# Altium schematic sheet 01_VERSION_HISTORY.SchDoc: =TitleParameter
size A3; Address: Crete IL; Organization: ASISGUARD; Address1: Kemalpasa, Kemalpasa Cd. No:290 D:292H, 35060 Bornova/Izmir/Turkey
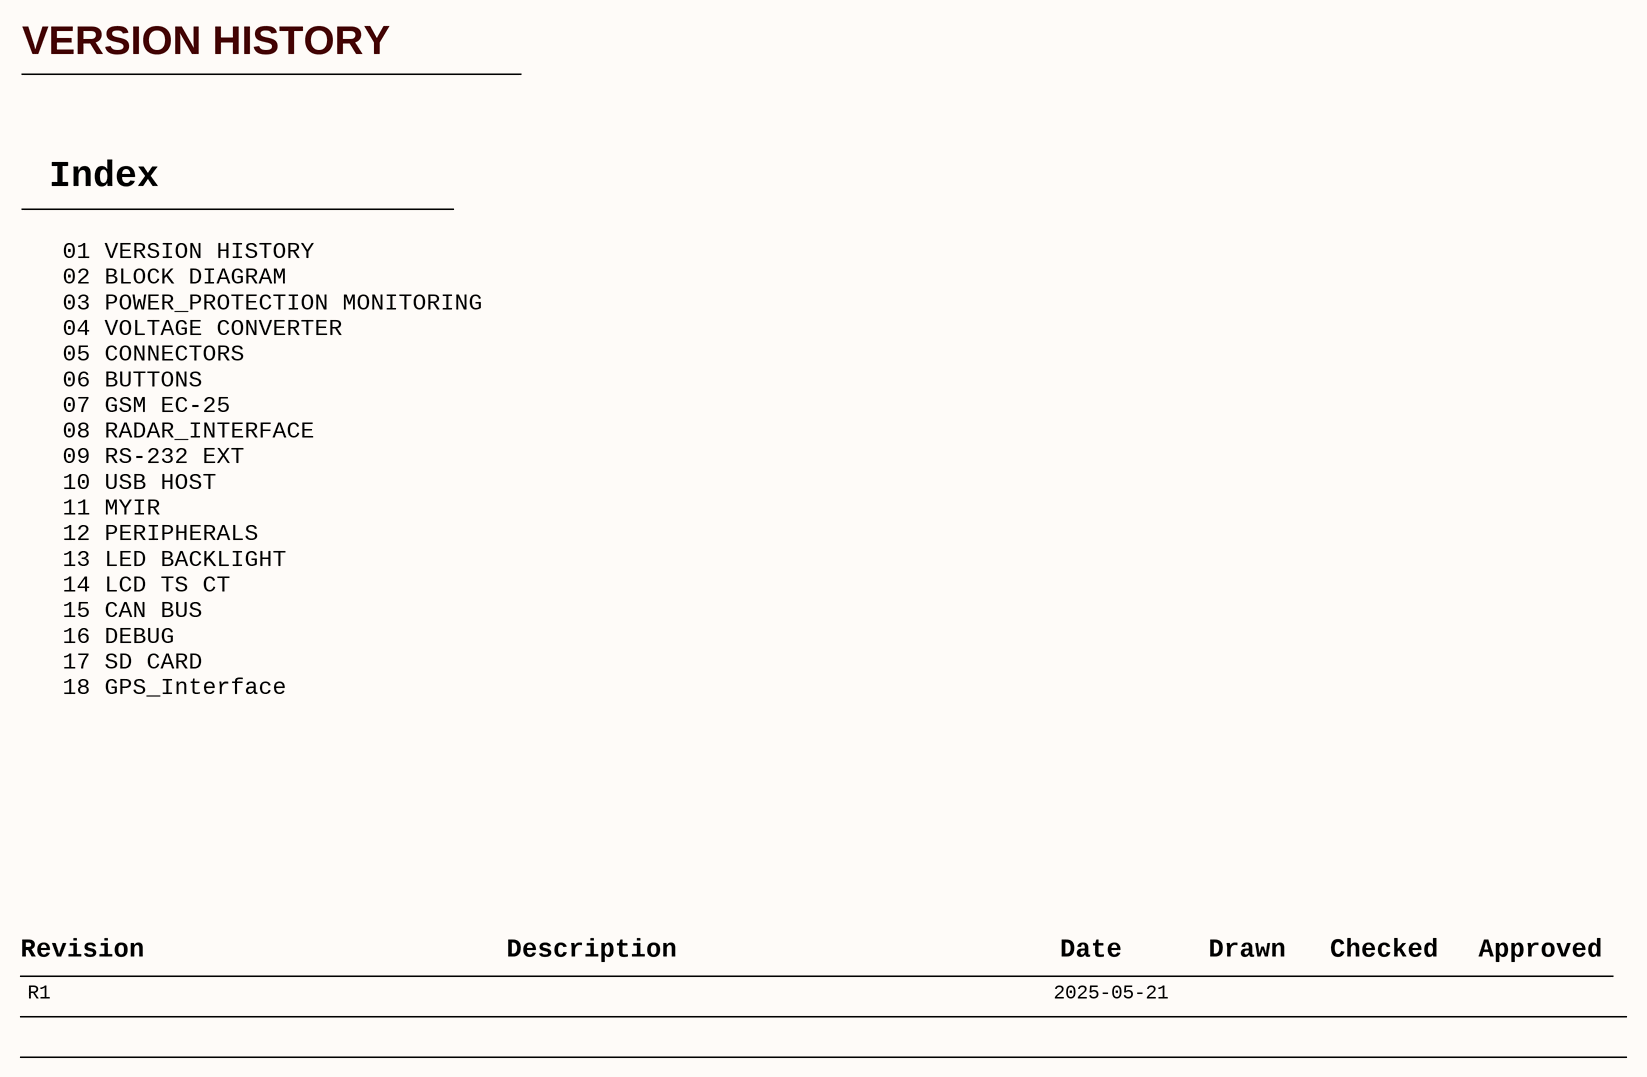
[diagram p0: 01_VERSION_HISTORY.SchDoc]

## Notes on the sheet
- VERSION HISTORY
- Index
- 01 VERSION HISTORY
  02 BLOCK DIAGRAM
  03 POWER_PROTECTION MONITORING
  04 VOLTAGE CONVERTER
  05 CONNECTORS
  06 BUTTONS
  07 GSM EC-25
  08 RADAR_INTERFACE
  09 RS-232 EXT
  10 USB HOST
  11 MYIR
  12 PERIPHERALS
  13 LED BACKLIGHT
  14 LCD TS CT
  15 CAN BUS
  16 DEBUG                                                                        17 SD CARD
  18 GPS_Interface
- Revision
- Description
- Date
- Drawn
- Checked
- Approved
- R1
- 2025-05-21
- Proje/Project:
- Sayfa Adı/Document Name:
- Çizilme Tarihi/Drawing Date
- Umit KAYACIK
- Tasarlayan/Designed By
- Sayfa/Sheet:
- Revision:
- of
- Son Güncelleme/Last Edit Date
- Kontrol eden/Checked By
- Onaylayan/Approved By
- Boyut/Size:
- Varyant/Variant:
- Dil/Language:
- A3
- ENG